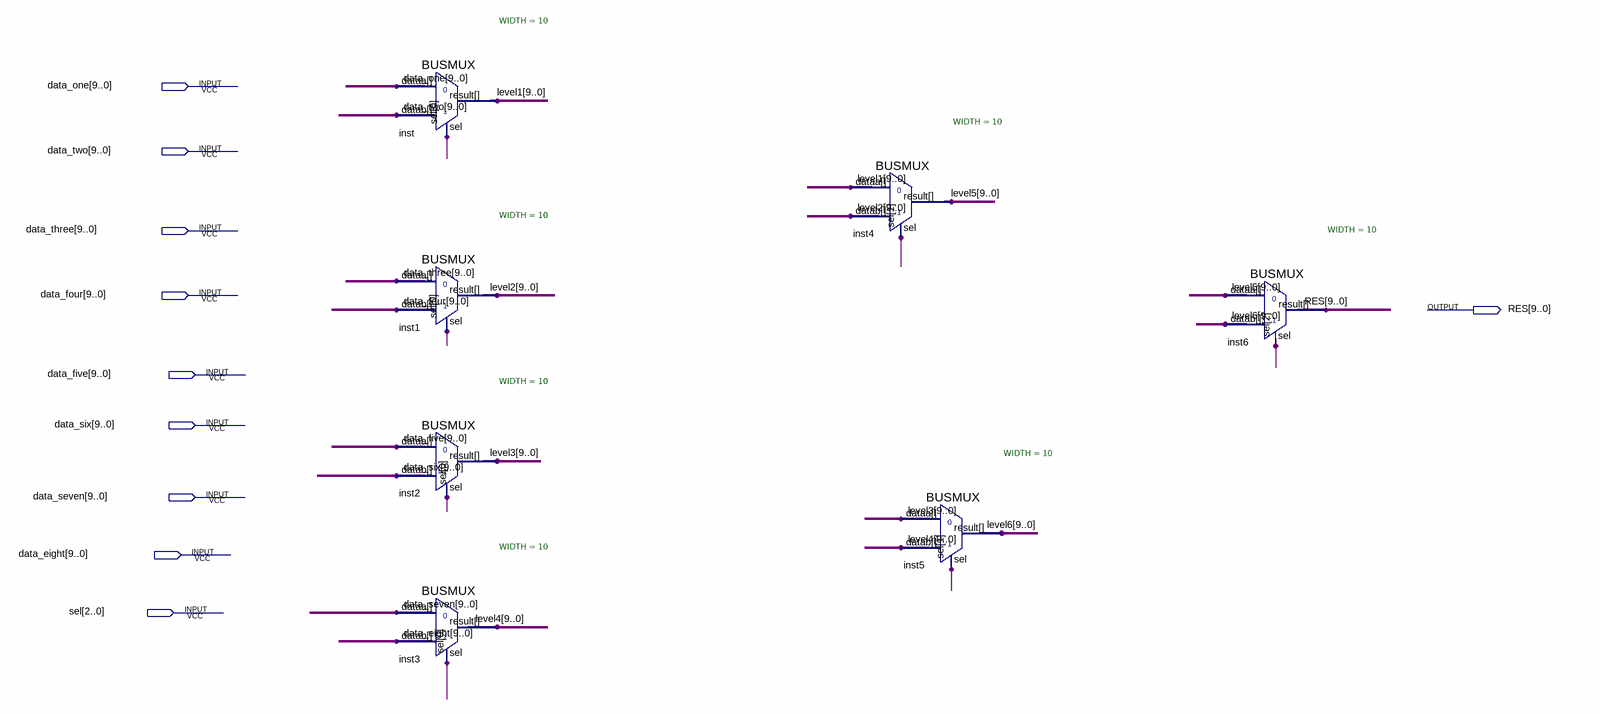
[diagram p0: schematic sheet]
// Quartus schematic mux8.bdf as structural Verilog: 7 symbols, 10 pins
module mux8 (
  input  [9:0] data_one,
  input  [9:0] data_two,
  input  [9:0] data_three,
  input  [9:0] data_four,
  input  [9:0] data_five,
  input  [9:0] data_six,
  input  [9:0] data_seven,
  input  [9:0] data_eight,
  input  [2:0] sel,
  output [9:0] RES
);

  wire [9:0] level1, level2, level3, level4, level5, level6;

  BUSMUX #(.WIDTH(10)) inst (.datab(data_two), .sel(sel[0]), .dataa(data_one), .result(level1));
  BUSMUX #(.WIDTH(10)) inst1 (.datab(data_four), .sel(sel[0]), .dataa(data_three), .result(level2));
  BUSMUX #(.WIDTH(10)) inst2 (.datab(data_six), .sel(sel[0]), .dataa(data_five), .result(level3));
  BUSMUX #(.WIDTH(10)) inst3 (.datab(data_eight), .sel(sel[0]), .dataa(data_seven), .result(level4));
  BUSMUX #(.WIDTH(10)) inst4 (.datab(level2), .sel(sel[1]), .dataa(level1), .result(level5));
  BUSMUX #(.WIDTH(10)) inst5 (.datab(level4), .sel(sel[1]), .dataa(level3), .result(level6));
  BUSMUX #(.WIDTH(10)) inst6 (.datab(level6), .sel(sel[2]), .dataa(level5), .result(RES));
endmodule
